# EAGLE design untitled (EAGLE 9.5.2)
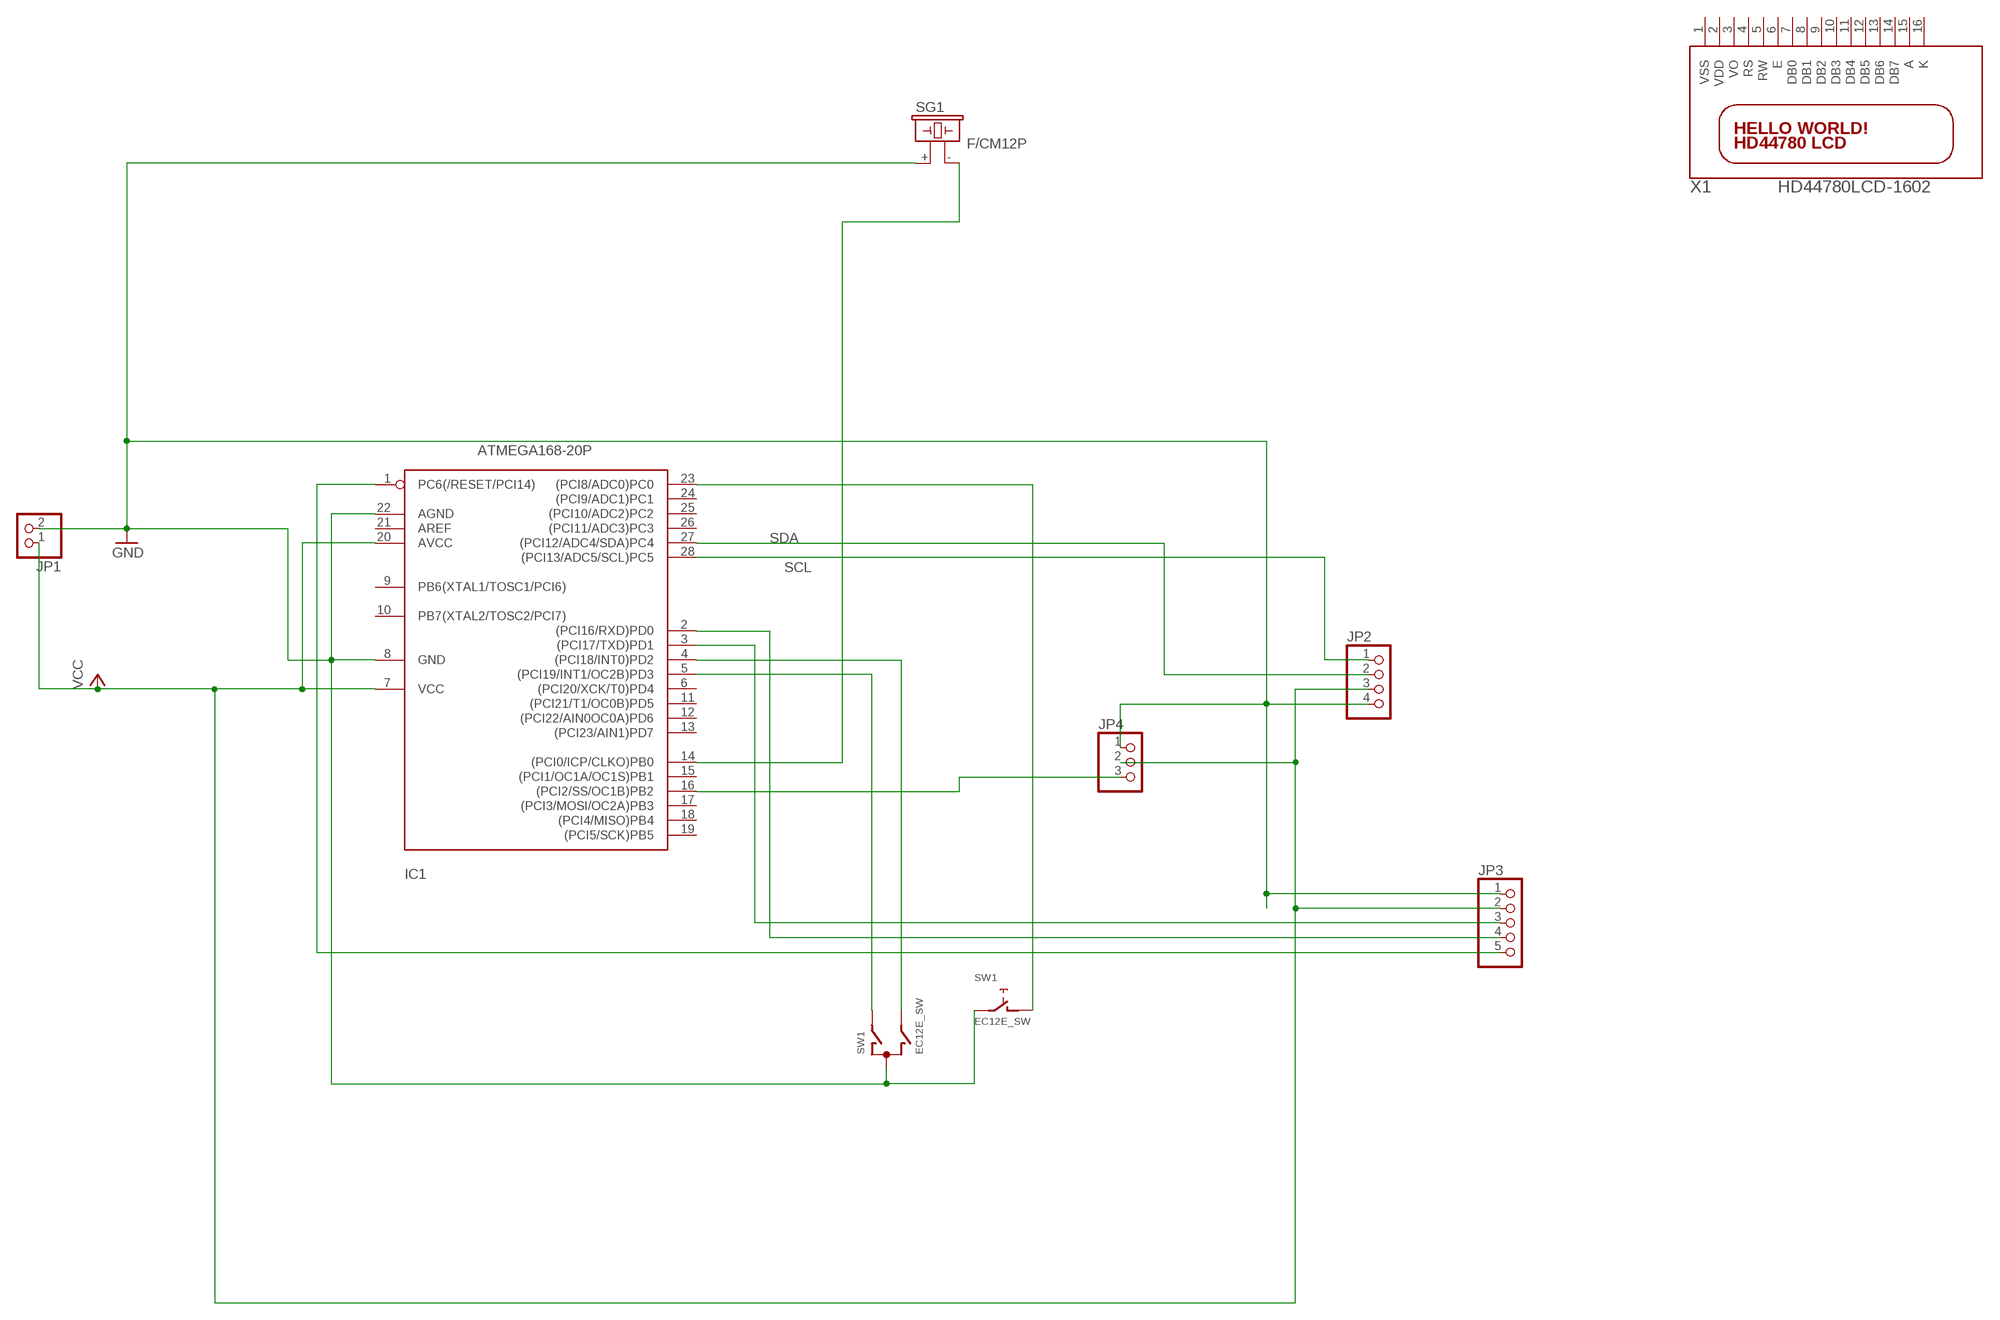
[diagram p0: schematic, sheet 1]

## Parts
IC1  ATMEGA168-20P  [DIL28-3]
JP1  PINHD-1X2  [1X02]
JP2  PINHD-1X4  [1X04]
JP3  PINHD-1X5  [1X05]
JP4  PINHD-1X3  [1X03]
SG1  F/CM12P  [F/CM12P]
SW1  EC12E_SW  [ALPS_EC12E_SW]
X1  HD44780LCD-1602  [LCD1602]

## Nets
GND: IC1.8(GND) IC1.22(AGND) JP1.2 JP2.4 JP3.1 JP4.1 SG1.+ SW1.C SW1.E
N$1: IC1.3((PCI17/TXD)PD1) JP3.3
N$2: IC1.23((PCI8/ADC0)PC0) SW1.D
N$3: IC1.4((PCI18/INT0)PD2) SW1.B
N$4: IC1.5((PCI19/INT1/OC2B)PD3) SW1.A
N$5: IC1.2((PCI16/RXD)PD0) JP3.4
N$6: IC1.14((PCI0/ICP/CLKO)PB0) SG1.-
N$7: IC1.1(PC6(/RESET/PCI14)) JP3.5
N$9: IC1.16((PCI2/SS/OC1B)PB2) JP4.3
SCL: IC1.28((PCI13/ADC5/SCL)PC5) JP2.1
SDA: IC1.27((PCI12/ADC4/SDA)PC4) JP2.2
VCC: IC1.7(VCC) IC1.20(AVCC) JP1.1 JP2.3 JP3.2 JP4.2
Unconnected: IC1.6((PCI20/XCK/T0)PD4) IC1.9(PB6(XTAL1/TOSC1/PCI6)) IC1.10(PB7(XTAL2/TOSC2/PCI7)) IC1.11((PCI21/T1/OC0B)PD5) IC1.12((PCI22/AIN0OC0A)PD6) IC1.13((PCI23/AIN1)PD7) IC1.15((PCI1/OC1A/OC1S)PB1) IC1.17((PCI3/MOSI/OC2A)PB3) IC1.18((PCI4/MISO)PB4) IC1.19((PCI5/SCK)PB5) IC1.21(AREF) IC1.24((PCI9/ADC1)PC1) IC1.25((PCI10/ADC2)PC2) IC1.26((PCI11/ADC3)PC3) SW1.GND1(G) SW1.GND2(G) X1.1(VSS) X1.2(VDD) X1.3(VO) X1.4(RS) X1.5(RW) X1.6(E) X1.7(DB0) X1.8(DB1) X1.9(DB2) X1.10(DB3) X1.11(DB4) X1.12(DB5) X1.13(DB6) X1.14(DB7) X1.15(A) X1.16(K)

## Library data of the parts
IC1 = adafruit:ATMEGA168*P: MICROCONTROLLER 16 kBytes FLASH 1 kBytes SRAM 512 Bytes EEPROM USART 8-channel 10 bit ADC
JP1 = pinhead:PINHD-1X2: PIN HEADER
JP2 = pinhead:PINHD-1X4: PIN HEADER
JP3 = pinhead:PINHD-1X5: PIN HEADER
JP4 = pinhead:PINHD-1X3: PIN HEADER
SG1 = buzzer:F/CM12P: BUZZER Source: Buerklin; OC_FARNELL: unknown; OC_NEWARK: unknown
SW1 = switch-alps:EC12E_SW: ALPS rotary Encoder EC12E series with switch; MPN: EC12E2424407; OC_FARNELL: 1520813; OC_NEWARK: 74M1068
X1 = adafruit:HD44780LCD: HD44780 LCD Standard character type LCDs, available in sizes from 8x1 to 40x4!

## Board
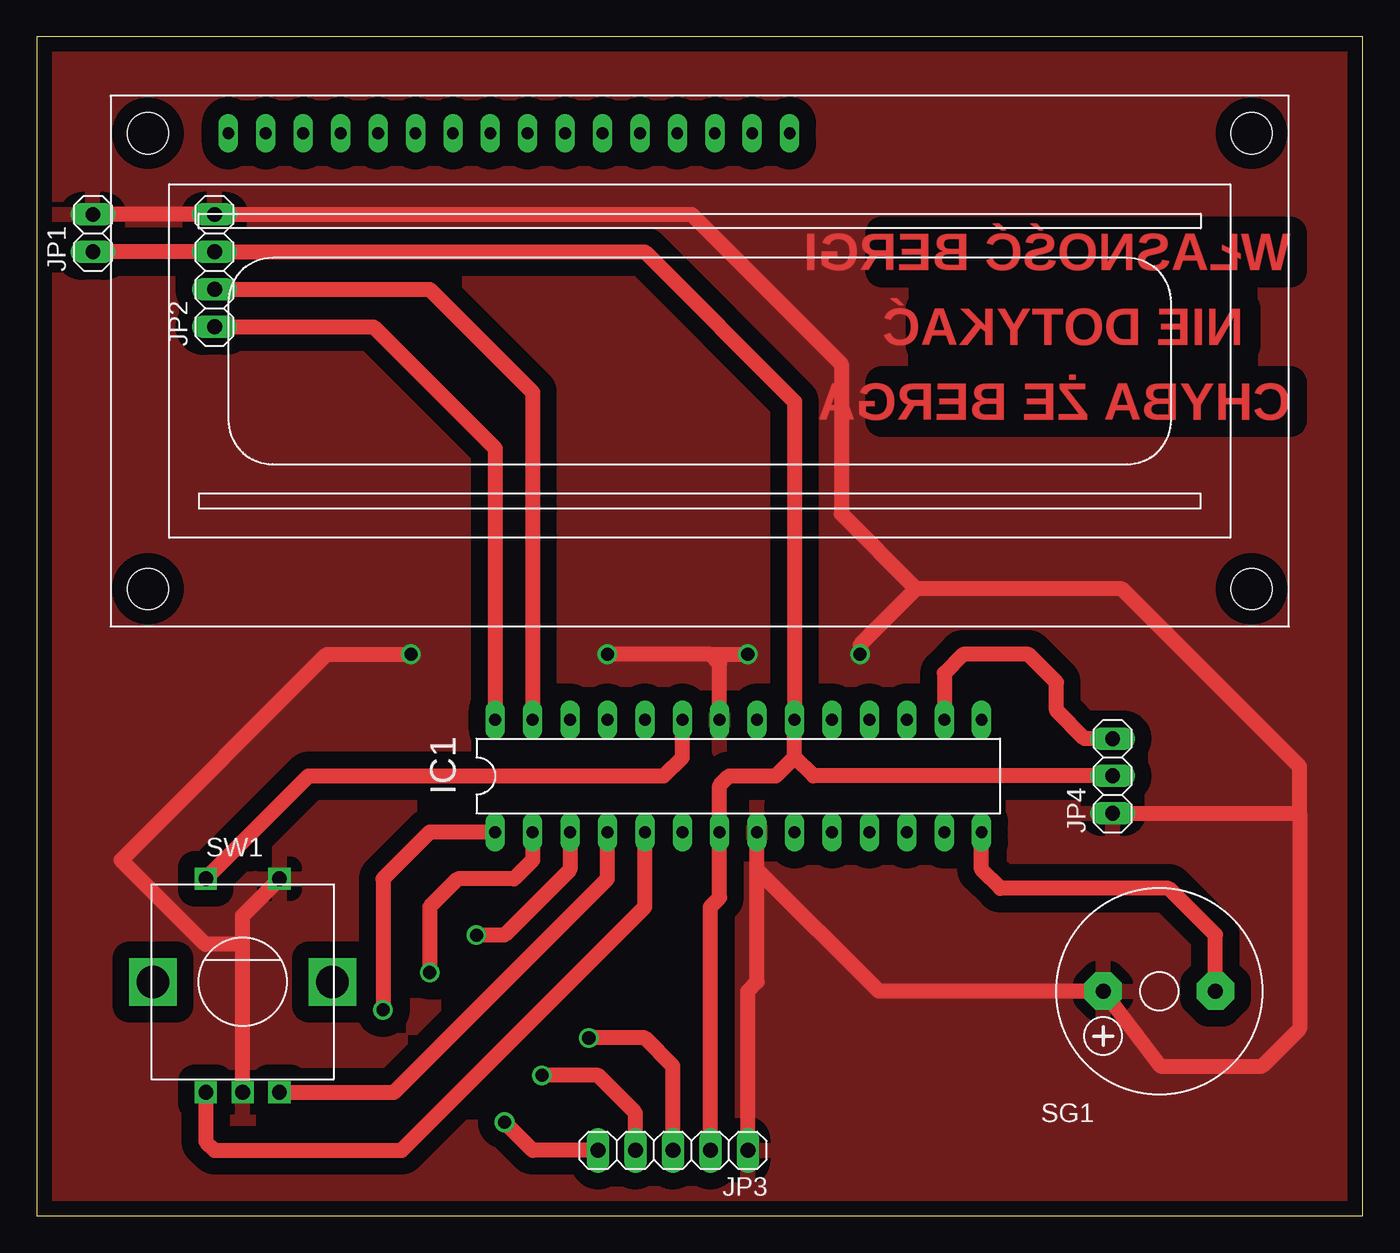
[diagram p1: board, top side]
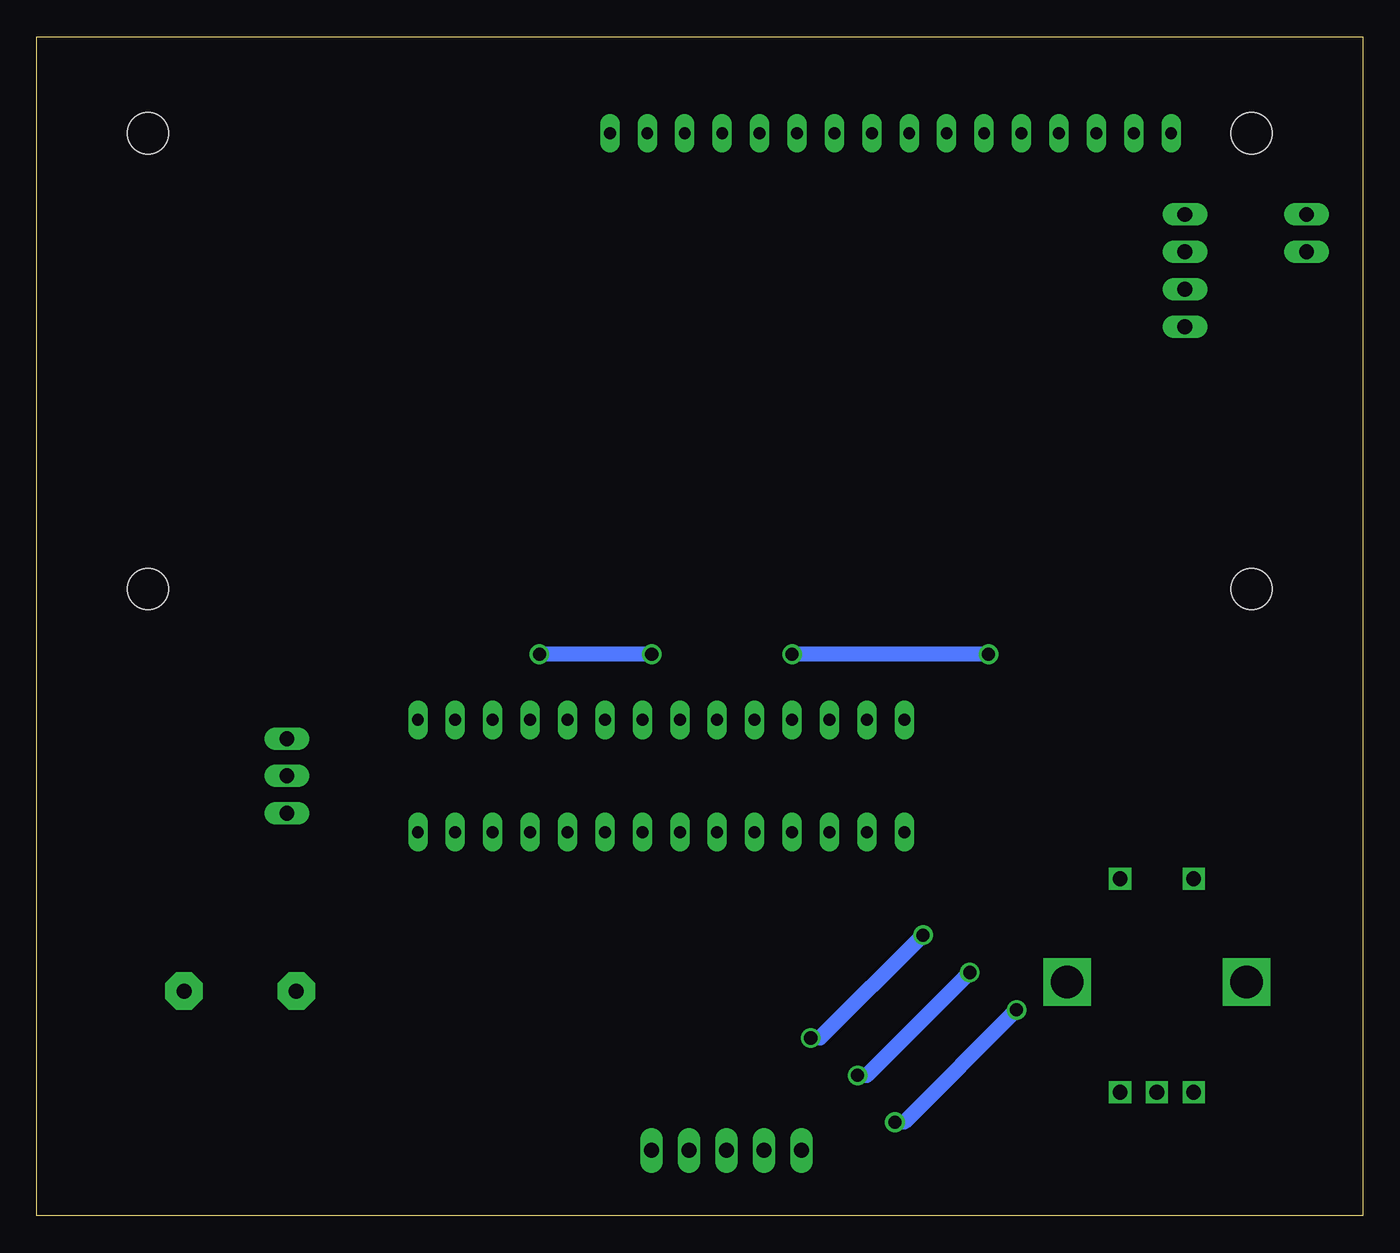
[diagram p2: board, bottom side, seen from below]

Size 90 x 80 mm. Coordinates in mm from the lower left corner, seen from the top.
Outline: 0,0 90,0 90,80 0,80 0,0
Copper layers (1*16): Top 0.035mm / dielectric 1.5mm / Bottom 0.035mm
Design rules "default *": minimum track width 40mil, minimum drill 0.35mm, track to track 45mil, track to pad 20mil, pad to pad 20mil, via to via 20mil, smd to smd 20mil, copper to edge 40mil, drill to drill 20mil, minimum pad ring 10mil, minimum via ring 8mil, stop-mask expansion 4mil, vias tented up to drill 0mil, thermal gap 30mil

### Footprints (pad centres in the part's own frame; a part is rotated, then mirrored left to right if it is on the bottom)
DIL28-3 = drill 0.813 long: 1 -16.51,-3.81; 2 -13.97,-3.81; 3 -11.43,-3.81; 4 -8.89,-3.81; 5 -6.35,-3.81; 6 -3.81,-3.81; 7 -1.27,-3.81; 8 1.27,-3.81; 9 3.81,-3.81; 10 6.35,-3.81; 11 8.89,-3.81; 12 11.43,-3.81; 13 13.97,-3.81; 14 16.51,-3.81; 15 16.51,3.81; 16 13.97,3.81; 17 11.43,3.81; 18 8.89,3.81; 19 6.35,3.81; 20 3.81,3.81; 21 1.27,3.81; 22 -1.27,3.81; 23 -3.81,3.81; 24 -6.35,3.81; 25 -8.89,3.81; 26 -11.43,3.81; 27 -13.97,3.81; 28 -16.51,3.81
1X02 = drill 1.016 long: 1 -1.27,0; 2 1.27,0
1X04 = drill 1.016 long: 1 -3.81,0; 2 -1.27,0; 3 1.27,0; 4 3.81,0
1X05 = drill 1.016 long: 1 -5.08,0; 2 -2.54,0; 3 0,0; 4 2.54,0; 5 5.08,0
1X03 = drill 1.016 long: 1 -2.54,0; 2 0,0; 3 2.54,0
F/CM12P = drill 1.016 pad 2.54 octagon: + 3.81,0; - -3.81,0
ALPS_EC12E_SW = drill 1 square: A -2.5,-7.5; B 2.5,-7.5; C 0,-7.5; D -2.5,7; E 2.5,7 | drill 2.2 square: GND1 -6.1,0; GND2 6.1,0
LCD1602 = drill 0.8 long: 1 8,33.46; 2 10.54,33.46; 3 13.08,33.46; 4 15.62,33.46; 5 18.16,33.46; 6 20.7,33.46; 7 23.24,33.46; 8 25.78,33.46; 9 28.32,33.46; 10 30.86,33.46; 11 33.4,33.46; 12 35.94,33.46; 13 38.48,33.46; 14 41.02,33.46; 15 43.56,33.46; 16 46.1,33.46 | hole 2.8: 2.54,2.54; 2.54,33.46; 77.46,33.46; 77.46,2.54

### Placement (x,y rotation side)
IC1  47.62,29.84 0 top
JP1  3.81,66.67 90 top
JP2  12.06,64.14 90 top
JP3  43.18,4.45 180 top
JP4  73.03,29.84 90 top
SG1  76.2,15.24 180 top
SW1  13.97,15.88 0 top
X1  5,40 0 top

### Tracks (layer width: path | path; a pad name or v marks a point on that pad's centre or on a via)
GND  (via drill 0.89)
  Top 1.016: JP1.2 JP2.4 44.45,67.94 54.61,57.78 54.61,47.62 59.69,42.55 | SW1.C 13.97,18.41 | 13.97,18.41 13.97,20.38 SW1.E | 48.9,23.5 57.15,15.24 SG1.+ 76.28,10.16 83.19,10.16 85.72,12.7 85.72,27.3 | 48.9,23.5 IC1.8 | JP3.1 48.26,15.24 48.9,15.88 48.9,23.5 | 13.97,18.41 11.43,18.41 5.71,24.13 19.68,38.1 v25.4,38.1 | IC1.22 46.35,37.47 45.72,38.1 | 45.72,38.1 v38.73,38.1 | 45.72,38.1 v48.26,38.1 | JP4.1 85.72,27.3 | 85.72,27.3 85.72,30.48 73.66,42.55 59.69,42.55 | 59.69,42.55 55.88,38.73 v55.88,38.1
  Bottom 1.016: v25.4,38.1 v38.73,38.1 | v48.26,38.1 v55.88,38.1
  pour Top: 0,80.01 0,0 90.17,0 90.17,80.01
N$1  (via drill 0.89)
  Top 1.016: IC1.3 36.2,23.5 31.75,19.05 v29.84,19.05 | JP3.3 43.18,10.16 41.27,12.06 v37.47,12.06
  Bottom 1.016: v29.84,19.05 36.83,12.06 v37.47,12.06
N$2
  Top 1.016: SW1.D 18.44,29.84 42.55,29.84 43.81,31.11 IC1.23
N$3
  Top 1.016: SW1.B 24.25,8.38 38.73,22.86 IC1.4
N$4
  Top 1.016: SW1.A 11.47,5.04 12.06,4.45 24.77,4.45 41.27,20.95 IC1.5
N$5  (via drill 0.89)
  Top 1.016: JP3.4 40.64,6.99 38.1,9.53 v34.29,9.53 | IC1.2 33.66,24.13 32.38,22.86 28.57,22.86 26.67,20.95 v26.67,16.51
  Bottom 1.016: v26.67,16.51 33.66,9.53 v34.29,9.53
N$6
  Top 1.016: SG1.- 80.01,19.1 79.93,19.13 76.83,22.23 65.41,22.23 64.14,23.5 IC1.14
N$7  (via drill 0.89)
  Top 1.016: IC1.1 26.67,26.04 23.5,22.86 v23.5,13.97 | JP3.5 33.66,4.45 v31.75,6.35
  Bottom 1.016: v23.5,13.97 31.11,6.35 v31.75,6.35
N$9
  Top 1.016: JP4.3 71.12,32.38 69.22,34.29 69.22,36.2 67.31,38.1 62.87,38.1 61.59,36.83 IC1.16
SCL
  Top 1.016: JP2.1 22.86,60.33 31.11,52.07 IC1.28
SDA
  Top 1.016: JP2.2 26.67,62.87 33.66,55.88 IC1.27
VCC
  Top 1.016: JP1.1 JP2.3 41.27,65.41 51.44,55.24 IC1.20 51.44,31.11 | 51.44,31.11 50.16,29.84 46.99,29.84 46.35,29.21 IC1.7 46.35,21.59 45.72,20.95 JP3.2 | JP4.2 52.7,29.84 51.44,31.11

### Text on the board
Top: WŁASNOŚĆ BERGI | NIE DOTYKAĆ | CHYBA ŻE BERGA